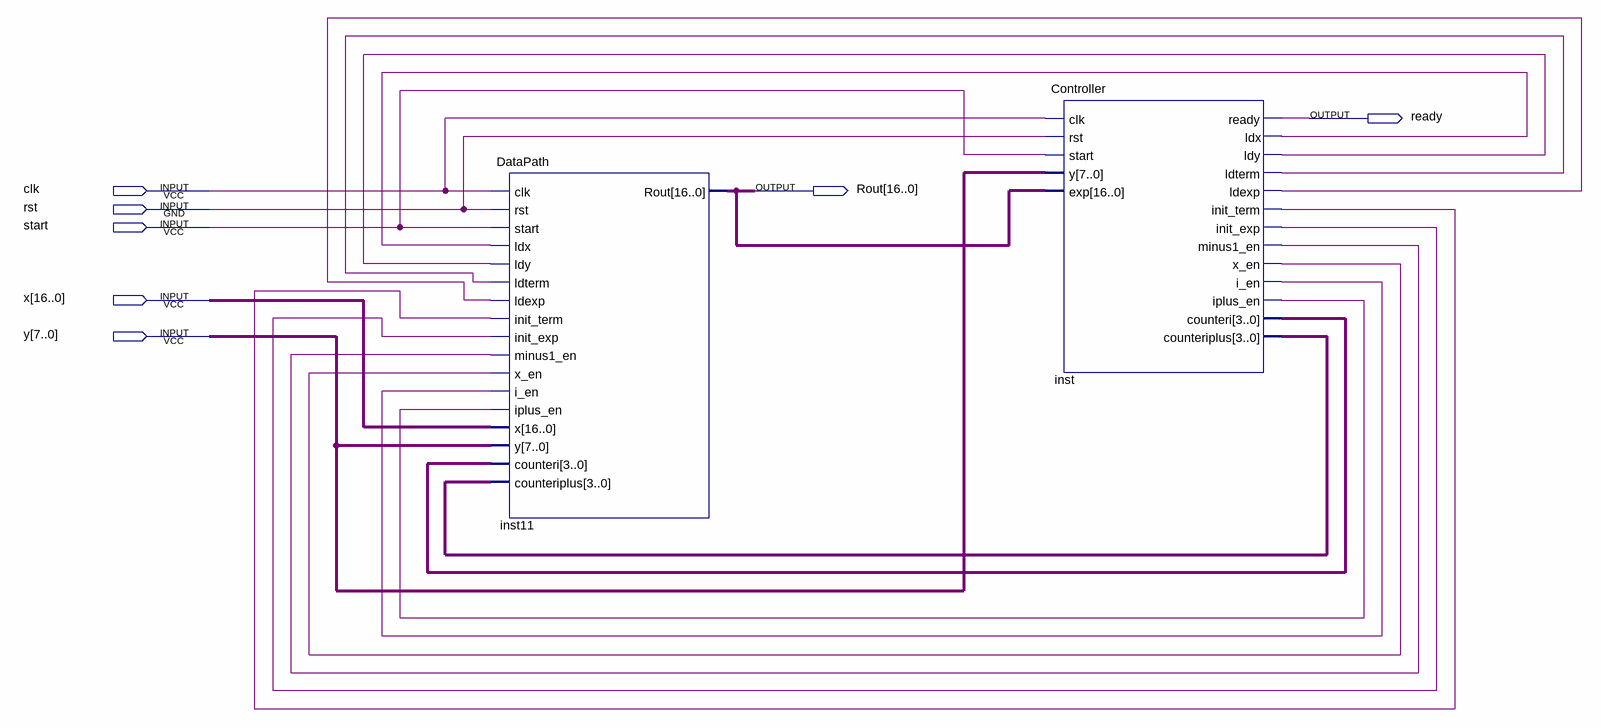
[diagram p0: schematic sheet]
// Quartus schematic CA6_Quartus.bdf as structural Verilog: 2 symbols, 7 pins
module CA6_Quartus (
  input  clk,
  input  rst,
  input  start,
  input  [16:0] x,
  input  [7:0] y,
  output ready,
  output [16:0] Rout
);

  wire inst_i_en, inst_init_exp, inst_init_term, inst_iplus_en, inst_ldexp, inst_ldterm, inst_ldx, inst_ldy,
       inst_minus1_en, inst_x_en;
  wire [3:0] inst_counteri, inst_counteriplus;

  DataPath inst11 (
    .clk(clk), .rst(rst), .start(start), .ldx(inst_ldx), .ldy(inst_ldy), .ldterm(inst_ldterm),
    .ldexp(inst_ldexp), .init_term(inst_init_term), .init_exp(inst_init_exp), .minus1_en(inst_minus1_en),
    .x_en(inst_x_en), .i_en(inst_i_en), .iplus_en(inst_iplus_en), .x(x), .y(y), .counteri(inst_counteri),
    .counteriplus(inst_counteriplus), .Rout(Rout));
  Controller inst (
    .clk(clk), .rst(rst), .start(start), .y(y), .exp(Rout), .ready(ready), .ldx(inst_ldx), .ldy(inst_ldy),
    .ldterm(inst_ldterm), .ldexp(inst_ldexp), .init_term(inst_init_term), .init_exp(inst_init_exp),
    .minus1_en(inst_minus1_en), .x_en(inst_x_en), .i_en(inst_i_en), .iplus_en(inst_iplus_en),
    .counteri(inst_counteri), .counteriplus(inst_counteriplus));
endmodule
